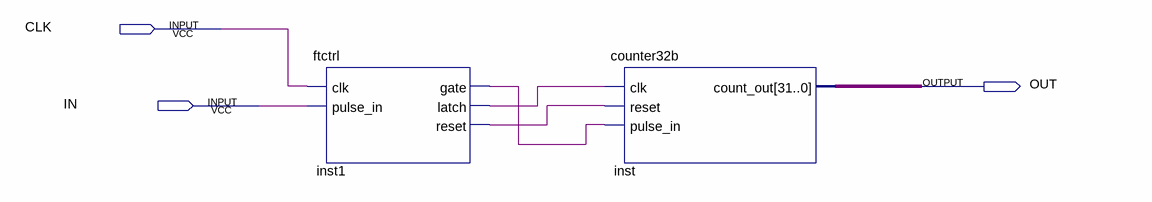
[diagram p0: schematic sheet]
// Quartus schematic Counter.bdf as structural Verilog: 2 symbols, 3 pins
module Counter (
  input  CLK,
  input  IN,
  output OUT
);

  wire inst1_gate, inst1_latch, inst1_reset;
  wire [31:0] inst_count_out;

  ftctrl inst1 (.clk(CLK), .pulse_in(IN), .gate(inst1_gate), .latch(inst1_latch), .reset(inst1_reset));
  counter32b inst (.clk(inst1_latch), .reset(inst1_reset), .pulse_in(inst1_gate), .count_out(inst_count_out));
endmodule
